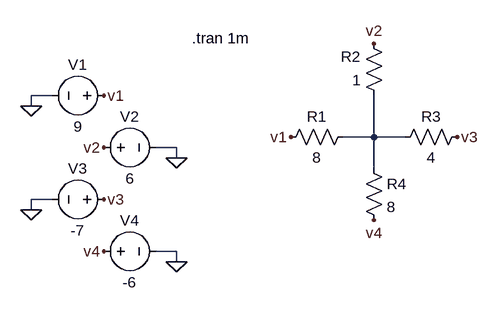
[diagram p0: schematic Q1 att 3.asc]
Q1 att 3.asc, the LTspice schematic file:
Version 4.1
SHEET 1 880 680
WIRE -352 112 -384 112
WIRE -384 128 -384 112
WIRE 144 176 144 112
WIRE 144 176 96 176
WIRE 192 176 144 176
WIRE -160 192 -192 192
WIRE -160 208 -160 192
WIRE 144 224 144 176
WIRE -352 272 -384 272
WIRE -384 288 -384 272
WIRE -160 352 -192 352
WIRE -160 368 -160 352
FLAG 16 176 v1
FLAG 144 32 v2
FLAG 272 176 v3
FLAG 144 304 v4
FLAG -272 112 v1
FLAG -272 192 v2
FLAG -272 272 v3
FLAG -272 352 v4
FLAG -160 368 0
FLAG -384 288 0
FLAG -160 208 0
FLAG -384 128 0
SYMBOL res 112 160 R90
WINDOW 0 0 56 VBottom 2
WINDOW 3 32 56 VTop 2
SYMATTR InstName R1
SYMATTR Value 8
SYMBOL res 160 128 R180
WINDOW 0 36 76 Left 2
WINDOW 3 36 40 Left 2
SYMATTR InstName R2
SYMATTR Value 1
SYMBOL res 176 192 R270
WINDOW 0 32 56 VTop 2
WINDOW 3 0 56 VBottom 2
SYMATTR InstName R3
SYMATTR Value 4
SYMBOL res 128 208 R0
SYMATTR InstName R4
SYMATTR Value 8
SYMBOL voltage -256 112 R90
WINDOW 0 -32 56 VBottom 2
WINDOW 3 32 56 VTop 2
WINDOW 123 0 0 Left 0
WINDOW 39 0 0 Left 0
SYMATTR InstName V1
SYMATTR Value 9
SYMBOL voltage -288 192 R270
WINDOW 0 32 56 VTop 2
WINDOW 3 -32 56 VBottom 2
WINDOW 123 0 0 Left 0
WINDOW 39 0 0 Left 0
SYMATTR InstName V2
SYMATTR Value 6
SYMBOL voltage -256 272 R90
WINDOW 0 -32 56 VBottom 2
WINDOW 3 32 56 VTop 2
WINDOW 123 0 0 Left 0
WINDOW 39 0 0 Left 0
SYMATTR InstName V3
SYMATTR Value -7
SYMBOL voltage -288 352 R270
WINDOW 0 32 56 VTop 2
WINDOW 3 -32 56 VBottom 2
WINDOW 123 0 0 Left 0
WINDOW 39 0 0 Left 0
SYMATTR InstName V4
SYMATTR Value -6
TEXT -136 24 Left 2 !.tran 1m

The netlist it stands for:
* Q1 att 3.asc
R1 N001 v1 8
R2 N001 v2 1
R3 N001 v3 4
R4 N001 v4 8
V1 v1 0 9
V2 v2 0 6
V3 v3 0 -7
V4 v4 0 -6
.tran 1m
.backanno
.end